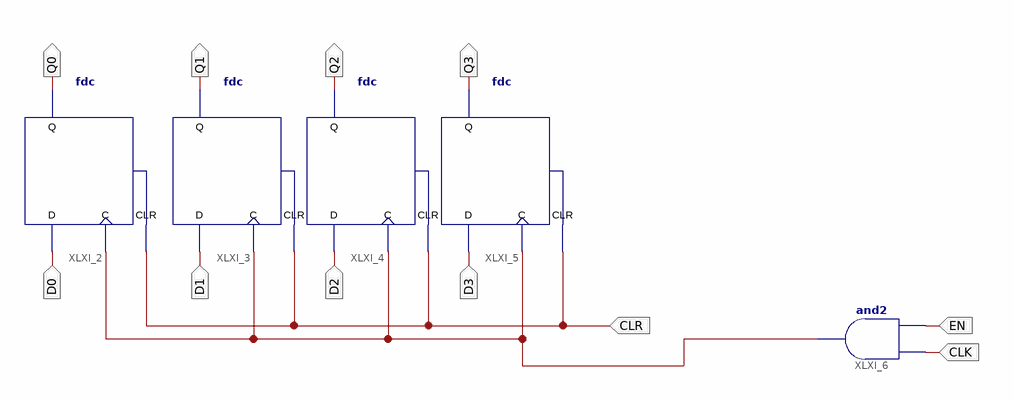
[diagram p0: schematic sheet 1]
// Xilinx ISE schematic REG_4.sch (spartan3e) as structural Verilog: 5 symbols, 11 ports
module REG_4 (
  input  CLR,
  input  D0,
  input  D1,
  input  D2,
  input  D3,
  input  EN,
  input  CLK,
  output Q0,
  output Q1,
  output Q2,
  output Q3
);

  wire XLXN_1;

  fdc XLXI_2 (.C(XLXN_1), .CLR(CLR), .D(D0), .Q(Q0));
  fdc XLXI_3 (.C(XLXN_1), .CLR(CLR), .D(D1), .Q(Q1));
  fdc XLXI_4 (.C(XLXN_1), .CLR(CLR), .D(D2), .Q(Q2));
  fdc XLXI_5 (.C(XLXN_1), .CLR(CLR), .D(D3), .Q(Q3));
  and XLXI_6 (XLXN_1, EN, CLK);
endmodule
